# Altium schematic sheet ShiftRegister.SchDoc
size A4; SheetNumber: 13; SheetTotal: 16
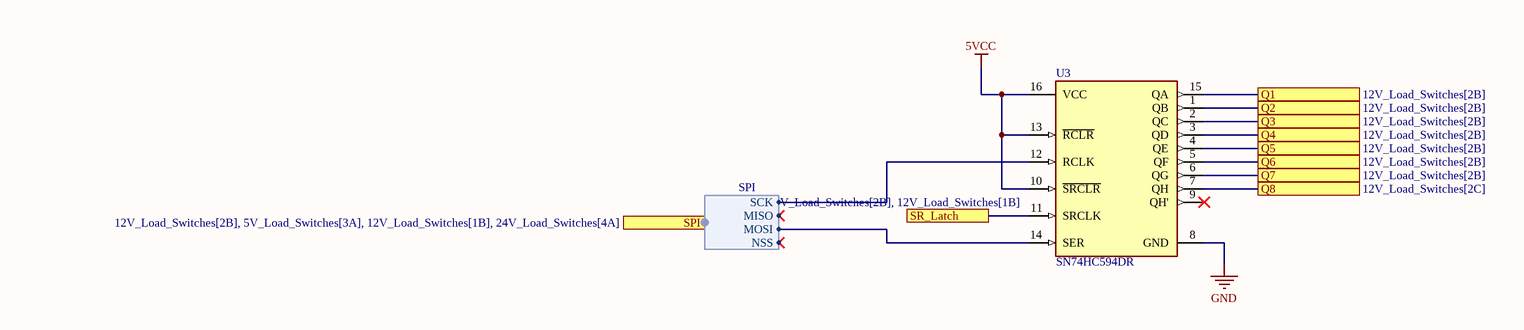
[diagram p0: ShiftRegister.SchDoc]

## Parts
U3  SN74HC594DR  [FP-D0016A-IPC_A]

## Ports
Q1 (see 12V_Load_Switches[2B]), Q2 (see 12V_Load_Switches[2B]), Q3 (see 12V_Load_Switches[2B]), Q4 (see 12V_Load_Switches[2B]), Q5 (see 12V_Load_Switches[2B]), Q6 (see 12V_Load_Switches[2B]), Q7 (see 12V_Load_Switches[2B]), Q8 (see 12V_Load_Switches[2C]), SPI (harness SPI, see 12V_Load_Switches[2B], 5V_Load_Switches[3A], 12V_Load_Switches[1B], 24V_Load_Switches[4A]), SR_Latch (see 12V_Load_Switches[2B], 12V_Load_Switches[1B])

## Harnesses
SPI: NSS, SCK, MISO, MOSI

## Nets
5VCC: U3.10(~{SRCLR}) U3.13(~{RCLR}) U3.16(VCC)
GND: U3.8(GND)
Q1: U3.15(QA) ; port Q1
Q2: U3.1(QB) ; port Q2
Q3: U3.2(QC) ; port Q3
Q4: U3.3(QD) ; port Q4
Q5: U3.4(QE) ; port Q5
Q6: U3.5(QF) ; port Q6
Q7: U3.6(QG) ; port Q7
Q8: U3.7(QH) ; port Q8
SR_Latch: U3.11(SRCLK) ; port SR_Latch
NetU3_12: U3.12(RCLK) ; port SPI.SCK
NetU3_14: U3.14(SER) ; port SPI.MOSI

Not connected (* = marked no-connect by the designer): U3 9(QH')*

## Library data of the parts
U3 = CMP-0780-00061-4: IC SHIFT REGISTER 8BIT 16-SOIC; Number of Bits per Element: 8; Min Supply Voltage: 2V; Frequency: 40MHz; Max Supply Voltage: 6V; Operating Supply Voltage: 5V; Number of Output Lines: 10; Propagation Delay: 25ns; Number of Elements: 1; Number of Circuits: 4; Direction: Unidirectional; Turn-On Delay Time: 185ns; RoHS Compliant: Yes; Width: 3.91mm; Length: 9.9mm; Min Operating Temperature: -40°C; Max Operating Temperature: 125°C; Package Quantity: 2500; Series: 74HC; Height: 1.58mm; Number of Bits: 8; Mount: Surface Mount; Logic Function: Shift Register; Radiation Hardening: No; Number of Pins: 16; Technology: CMOS; Packaging: Tape and Reel; Lead Free: Lead Free; Weight: 0.004998oz; REACH SVHC: No SVHC; Case/Package: SOIC